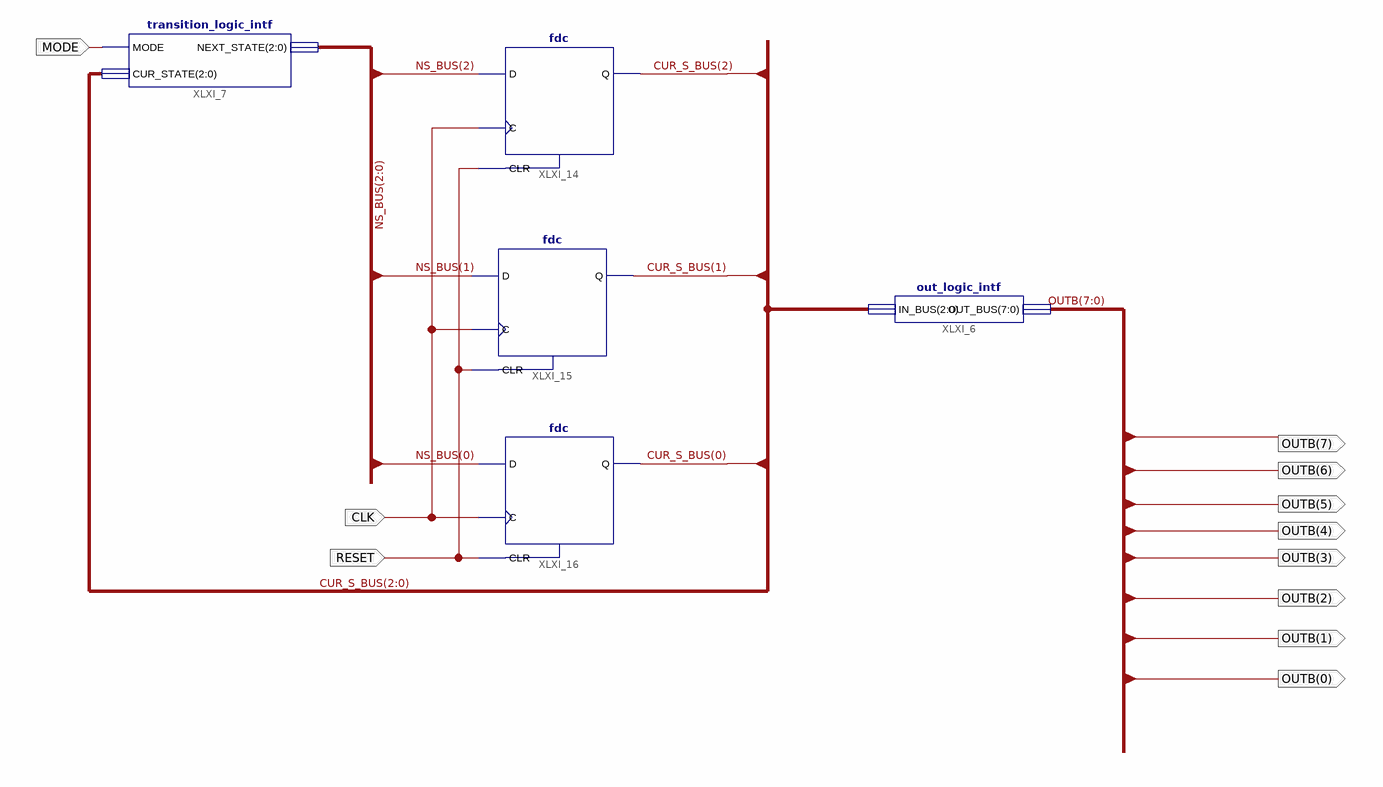
[diagram p0: schematic sheet 1]
// Xilinx ISE schematic LightController1.sch (spartan3a) as structural Verilog: 5 symbols, 11 ports
module LightController1 (
  input  MODE,
  input  CLK,
  input  RESET,
  output [7:0] OUTB
);

  wire [2:0] CUR_S_BUS, NS_BUS;

  out_logic_intf XLXI_6 (.IN_BUS(CUR_S_BUS), .OUT_BUS(OUTB));
  transition_logic_intf XLXI_7 (.MODE(MODE), .CUR_STATE(CUR_S_BUS), .NEXT_STATE(NS_BUS));
  fdc XLXI_14 (.C(CLK), .CLR(RESET), .D(NS_BUS[2]), .Q(CUR_S_BUS[2]));
  fdc XLXI_15 (.C(CLK), .CLR(RESET), .D(NS_BUS[1]), .Q(CUR_S_BUS[1]));
  fdc XLXI_16 (.C(CLK), .CLR(RESET), .D(NS_BUS[0]), .Q(CUR_S_BUS[0]));
endmodule
